# Altium schematic sheet Ethernet.SchDoc: Ethernet
size A3; DocumentNumber: MB1246; Revision: B.1; SheetNumber: 7; SheetTotal: 17; Project: STM32H7xxI-EVAL
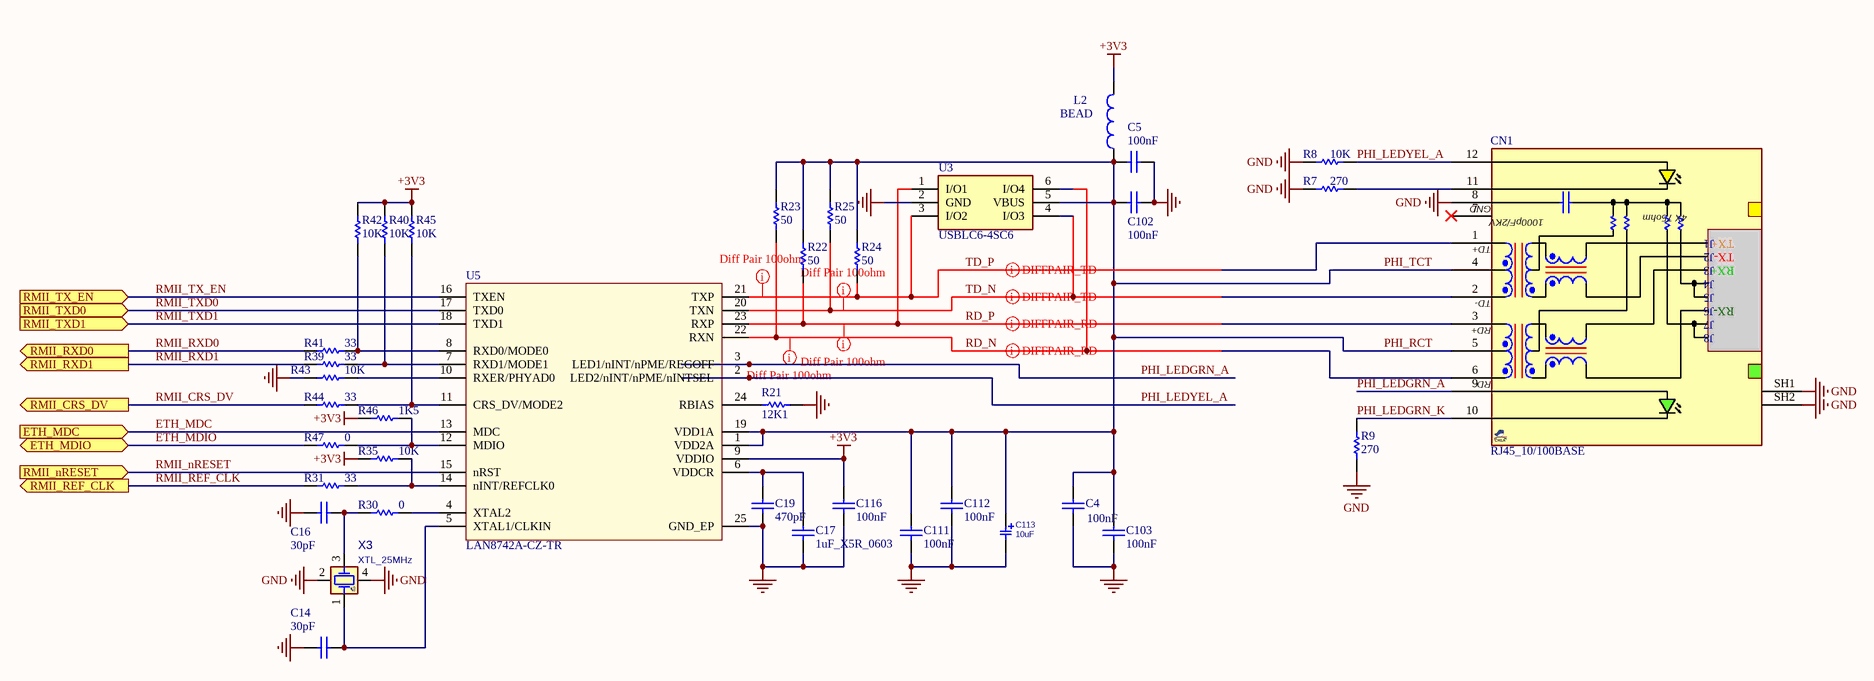
[diagram p0: Ethernet.SchDoc]

## Parts
C4  100nF  [C0603E]
C5  100nF  [C0603E]
C14  30pF  [C0603E]
C16  30pF  [C0603E]
C17  1uF_X5R_0603  [C0603E]
C19  470pF  [C0603E]
C102  100nF  [C0603E]
C103  100nF  [C0603E]
C111  100nF  [C0603E]
C112  100nF  [C0603E]
C113  10uF  [C_TN_3216]
C116  100nF  [C0603E]
CN1  RJ45_10/100BASE  [RJ45_8M_HR911105A]
L2  BEAD  [L0603E]
R7  270  [R0603E]
R8  10K  [R0603E]
R9  270  [R0603E]
R21  12K1  [R0603E]
R22  50  [R0603E]
R23  50  [R0603E]
R24  50  [R0603E]
R25  50  [R0603E]
R30  0  [R0603E]
R31  33  [R0603E]
R35  10K  [R0603E]
R39  33  [R0603E]
R40  10K  [R0603E]
R41  33  [R0603E]
R42  10K  [R0603E]
R43  10K  [R0603E]
R44  33  [R0603E]
R45  10K  [R0603E]
R46  1K5  [R0603E]
R47  0  [R0603E]
U3  USBLC6-4SC6  [SOT95P280X145-6N]
U5  LAN8742A-CZ-TR  [QFN50P400X400X100-25N-D]
X3  XTL_25MHz  [XTL_4_3225]

## Ports
ETH_MDC (in), ETH_MDIO (bidir), RMII_CRS_DV (out), RMII_nRESET (in), RMII_REF_CLK (out), RMII_RXD0 (out), RMII_RXD1 (out), RMII_TX_EN (in), RMII_TXD0 (in), RMII_TXD1 (in)

## Nets
+3V3: C116.2 L2.2 R35.1 R40.1 R42.1 R45.1 R46.2 U5.9(VDDIO)
GND: C4.1 C5.1 C14.2 C16.2 C17.2 C19.1 C102.1 C103.1 C111.1 C112.1 C113.2 C116.1 CN1.8(CHSGND) CN1.SH1 CN1.SH2 R7.1 R8.1 R9.2 R21.2 R43.2 U3.2(GND) U5.25(GND_EP) X3.2(GND1) X3.4(GND2)
ETH_MDC: U5.13(MDC) ; port ETH_MDC
ETH_MDIO: R47.2 ; port ETH_MDIO
PHI_LEDGRN_A: CN1.9(GLED+) U5.3(LED1/nINT/nPME/REGOFF)
PHI_LEDGRN_K: CN1.10(GLED-) R9.1
PHI_LEDYEL_A: CN1.12(YLED+) R8.2 U5.2(LED2/nINT/nPME/nINTSEL)
PHI_RCT: C4.2 C5.2 C102.2 C103.2 C111.2 C112.2 C113.1 CN1.4(TCT) CN1.5(RCT) L2.1 R22.2 R23.2 R24.2 R25.2 U3.5(VBUS) U5.1(VDD2A) U5.19(VDD1A)  [also labelled PHI_TCT]
RD_N: CN1.6(RD-) R23.1 U3.6(I/O4) U5.22(RXN)
RD_P: CN1.3(RD+) R22.1 U3.1(I/O1) U5.23(RXP)
RMII_CRS_DV: R44.2 ; port RMII_CRS_DV
RMII_nRESET: U5.15(nRST) ; port RMII_nRESET
RMII_REF_CLK: R31.2 ; port RMII_REF_CLK
RMII_RXD0: R41.2 ; port RMII_RXD0
RMII_RXD1: R39.2 ; port RMII_RXD1
RMII_TX_EN: U5.16(TXEN) ; port RMII_TX_EN
RMII_TXD0: U5.17(TXD0) ; port RMII_TXD0
RMII_TXD1: U5.18(TXD1) ; port RMII_TXD1
TD_N: CN1.2(TD-) R25.1 U3.4(I/O3) U5.20(TXN)
TD_P: CN1.1(TD+) R24.1 U3.3(I/O2) U5.21(TXP)
NetC14_1: C14.1 U5.5(XTAL1/CLKIN) X3.1(XA)
NetC16_1: C16.1 R30.2 X3.3(XB)
NetC17_1: C17.1 C19.2 U5.6(VDDCR)
NetCN1_11: CN1.11(YLED-) R7.2
NetR21_1: R21.1 U5.24(RBIAS)
NetR30_1: R30.1 U5.4(XTAL2)
NetR31_1: R31.1 R35.2 U5.14(nINT/REFCLK0)
NetR39_1: R39.1 R40.2 U5.7(RXD1/MODE1)
NetR41_1: R41.1 R42.2 U5.8(RXD0/MODE0)
NetR43_1: R43.1 U5.10(RXER/PHYAD0)
NetR44_1: R44.1 R45.2 U5.11(CRS_DV/MODE2)
NetR46_1: R46.1 R47.1 U5.12(MDIO)

Not connected (* = marked no-connect by the designer): CN1 7(NC)*

## Layout directives
differential pair: RD_N, RD_P, TD_N, TD_P
rule Matched Net Lengths [Tolerance = 100mil]: RD_N, RD_P, TD_N, TD_P

## Notes on the sheet
- Title:
- Project:
- Size:
- Date:
- A4
- Reference:
- Sheet:
- Revision:
- of
- (in symbol RJ45_HR911105A) GND; 4X 75ohm; 1000pF/2KV; J1; TX+; J2; TX-; J3; RX+; J4; J5; J6; RX-; J7; J8

## Library data of the parts
C4 C5 C102 C103 C111 C112 C116 = Capacitor_ST: Capacitor 0402 / 0603 / 0805; Revision: July-2002: Re-released for DXP Platform.; Value: 100nF
C14 C16 C19 = Capacitor_ST: Capacitor 0402 / 0603 / 0805; Value: 100nF; Revision: July-2002: Re-released for DXP Platform.
C17 = CAP SMD 0603  X5R 1µF 25V 10%: 0603  X5R 1µF; Rated voltage: 25V; Tolerance: 10%; Manufacturer: *; Manufacturer P/N: *; Order code Farnell: 1288202RL; Value: 1µF; Power: *; Technology: X5R; Temperature  Factor: *; Temperature Max: +125°C; Temperature Min: -55°C; STS Code: *
C113 = CAP_SMD_TAN_10uF_6.3V: CAP, SMD, TAN; PARAM: 20%, 300mOhm, -55~105oC; MANF: VISHAY; MANF_P#: T55A106M6R3C0300; PARAM2: 6.3V; PRICE: 0.46$; VALUE: 10uF
CN1 = RJ45_HR911105A: RJ45, 10/100BASE, G/Y LED; MANF: Hanrun; MANF_P#: HR911105A; PARAM2: 10/100BASE, G/Y LED; VALUE: RJ45_10/100BASE
L2 = Inductor: Value: 100uH; Published: 8-Jun-2000; Revision: July-2002: Re-released for DXP Platform.; Publisher: Altium Limited
R7 R9 = Resistor_ST: Resistor 0402 / 0603 / 0805; Value: 10K
R8 R35 R40 R42 R43 R45 = Resistor_ST: Resistor 0402 / 0603 / 0805; Value: 10K
R21 = Res_12K1_1%_0603: Resistor,12K1,0603,1%,VISHAY; Manuf_Part_1: MCT 0603-50 1% P5 12K1; Order: 2325243; Value: 12K1; ECCN_US/EU: n/a; Manuf_1: VISHAY; Distrib: FARNELL
R22-R25 = Res_50_1%_0603: Resistor,50,0603,1%,YAGEO; Manuf_Part_1: RC0402FR-0750RL; Value: 50; Manuf_1: YAGEO; Order: *; ECCN_US/EU: n/a; Distrib: FARNELL
R30 R47 = Res1: Resistor; Value: 1K; Published: 8-Jun-2000; Revision: July-2002: Re-released for DXP Platform.; Publisher: Altium Limited
R31 R39 R41 R44 = Res_33_1%_0402: Resistor,33,0402,1%,YAGEO; Manuf_Part_1: RC0402FR-0733RL; Value: 33; Manuf_1: YAGEO; Order: *; ECCN_US/EU: n/a; Distrib: FARNELL
R46 = Res_1K5_1%_0402: Resistor,1K5,0402,1%,YAGEO; Manuf_Part_1: RC0402FR-071K5L; Value: 1K5; Manuf_1: YAGEO; Order: RC0402FR-071K5L; ECCN_US/EU: n/a; Distrib: FARNELL
U3 = USBLC6-4SC6: Integrated Circuit; Manufacturer_Name: STMicroelectronics; Datasheet Link: http://www.st.com/st-web-ui/static/active/en/resource/technical/document/datasheet/CD00047494.pdf; Height: 1.45mm; Manufacturer_Part_Number: USBLC6-4SC6; Mouser Part Number: 511-USBLC6-4SC6; Mouser Price/Stock: https://www.mouser.co.uk/ProductDetail/STMicroelectronics/USBLC6-4SC6?qs=k9dH%2Fx4GHJCNdehb8zInZg%3D%3D; Arrow Part Number: USBLC6-4SC6; Arrow Price/Stock: https://www.arrow.com/en/products/usblc6-4sc6/stmicroelectronics?region=europe
U5 = LAN8742A-CZ-TR: LAN8742A-CZ-TR - Small Footprint RMII 10/100 Ethernet, Transceiver with HP Auto-MDIX and flexPWR Technology SQFN-24; Manuf_1: MICROCHIP; Order: LAN8742A-CZ-TR; Manuf_Part_1: LAN8742A-CZ-TR; Distrib: MICROCHIP
X3 = XTL_4_25MHz_3225: CRYSTAL 25.00 MHZ 18pF, 10PPM; MANF: EPSON; DESC: DESCRIPTION; DIST#: MOUSER; PARAM2: PARAM; MANF_P#: TSX-3225 25.0000MF10P-C3; ASSEMBLY: ASSEMBLY; PARAM: 10PPM; PRICE: 0.5$; VALUE: XTL_25MHz